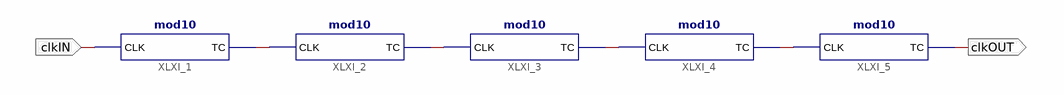
[diagram p0: schematic sheet 1]
// Xilinx ISE schematic Div100k.sch (spartan6) as structural Verilog: 5 symbols, 2 ports
module Div100k (
  input  clkIN,
  output clkOUT
);

  wire XLXN_1, XLXN_2, XLXN_3, XLXN_4;

  mod10 XLXI_1 (.CLK(clkIN), .TC(XLXN_1));
  mod10 XLXI_2 (.CLK(XLXN_1), .TC(XLXN_2));
  mod10 XLXI_3 (.CLK(XLXN_2), .TC(XLXN_3));
  mod10 XLXI_4 (.CLK(XLXN_3), .TC(XLXN_4));
  mod10 XLXI_5 (.CLK(XLXN_4), .TC(clkOUT));
endmodule
